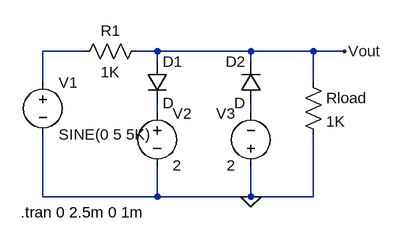
[diagram p0: schematic recortador polarizado.asc]
recortador polarizado.asc, the LTspice schematic file:
Version 4
SHEET 1 880 680
WIRE 160 64 96 64
WIRE 272 64 240 64
WIRE 416 64 272 64
WIRE 512 64 416 64
WIRE 560 64 512 64
WIRE 272 80 272 64
WIRE 416 80 416 64
WIRE 96 112 96 64
WIRE 512 112 512 64
WIRE 272 160 272 144
WIRE 416 160 416 144
WIRE 96 288 96 192
WIRE 272 288 272 240
WIRE 272 288 96 288
WIRE 416 288 416 240
WIRE 416 288 272 288
WIRE 512 288 512 192
WIRE 512 288 416 288
FLAG 416 288 0
FLAG 560 64 Vout
SYMBOL voltage 96 96 R0
WINDOW 123 0 0 Left 0
WINDOW 39 0 0 Left 0
SYMATTR InstName V1
SYMATTR Value SINE(0 5 5K)
SYMBOL voltage 272 144 R0
WINDOW 123 0 0 Left 0
WINDOW 39 0 0 Left 0
SYMATTR InstName V2
SYMATTR Value 2
SYMBOL voltage 416 256 R180
WINDOW 0 24 96 Left 2
WINDOW 3 24 16 Left 2
WINDOW 123 0 0 Left 0
WINDOW 39 0 0 Left 0
SYMATTR InstName V3
SYMATTR Value 2
SYMBOL res 256 48 R90
WINDOW 0 0 56 VBottom 2
WINDOW 3 32 56 VTop 2
SYMATTR InstName R1
SYMATTR Value 1K
SYMBOL res 496 96 R0
SYMATTR InstName Rload
SYMATTR Value 1K
SYMBOL diode 256 80 R0
SYMATTR InstName D1
SYMBOL diode 432 144 R180
WINDOW 0 24 64 Left 2
WINDOW 3 24 0 Left 2
SYMATTR InstName D2
TEXT 62 312 Left 2 !.tran 0 2.5m 0 1m

The netlist it stands for:
* recortador polarizado.asc
V1 N001 0 SINE(0 5 5K)
V2 N002 0 2
V3 0 N003 2
R1 Vout N001 1K
Rload Vout 0 1K
D1 Vout N002 D
D2 N003 Vout D
.model D D
.lib standard.dio
.tran 0 2.5m 0 1m
.backanno
.end